# Altium schematic sheet 5_BATT+3V3.SchDoc
size A4; SheetNumber: 6; SheetTotal: 12
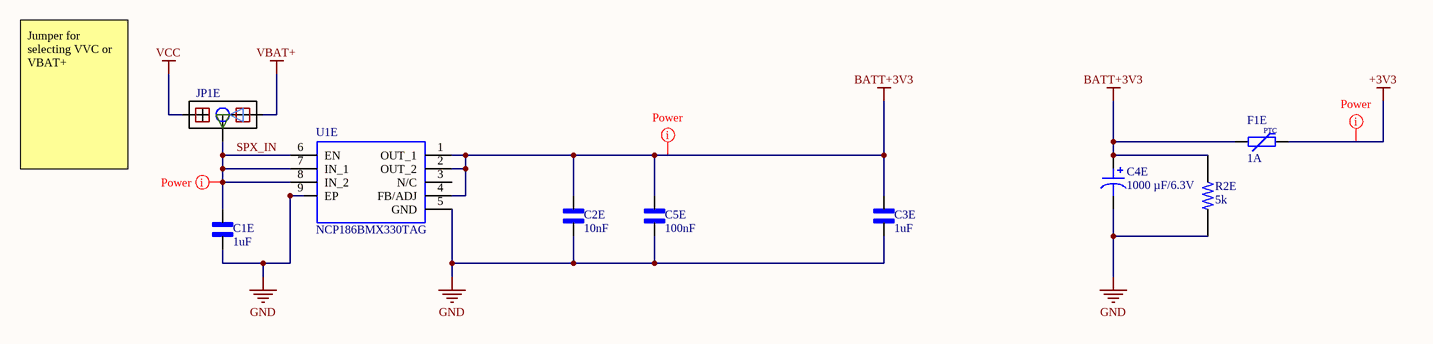
[diagram p0: 5_BATT+3V3.SchDoc]

## Parts
C1E  1uF  [C-0603]
C2E  10nF  [C-0603]
C3E  1uF  [C-0603]
C4E  1000 µF/6.3V  [CAP AL TH D8 L3.5 H12.5]
C5E  100nF  [C-0603]
F1E  1A  [FUSE_1206]
JP1E  Solder Pad  [Solder_Pad_3_Pin_NC_Medium]  (value not drawn)
R2E  5k  [R-0603]
U1E  NCP186BMX330TAG  [NCP186AMX330TAG]

## Nets
+3V3: F1E.2
BATT+3V3: C2E.2 C3E.2 C4E.1 C5E.2 F1E.1 R2E.1 U1E.1(OUT_1) U1E.2(OUT_2) U1E.4(FB/ADJ)
GND: C1E.1 C2E.1 C3E.1 C4E.2 C5E.1 R2E.2 U1E.5(GND) U1E.9(EP)
VBAT+: JP1E.1
VCC: JP1E.3
SPX_IN: C1E.2 JP1E.2 U1E.6(EN) U1E.7(IN_1) U1E.8(IN_2)

Not connected (* = marked no-connect by the designer): U1E 3(N/C)

## Layout directives
net class Power; rule Supply Nets [Voltage = 0.000]: +3V3, BATT+3V3, SPX_IN

## Notes on the sheet
- Jumper for selecting VVC or VBAT+
- (in symbol FUSE_PPTC_1206) PTC

## Library data of the parts
C1E C2E C3E C5E = C-0603: Ceramic Capacitor 16V 0603 (1608 Metric); MP: C0603C104J4RAC; MF: KEMET; SnapEDA_Link: https://www.snapeda.com/parts/C0603C104J4RAC/KEMET/view-part/1763758/?ref=snap; Availability: Warning; Package: 0603 KEMET; Check_prices: https://www.snapeda.com/parts/C0603C104J4RAC/KEMET/view-part/1763758/?ref=eda; Value: *; Price: None
C4E = ECA-0JHG102: CAP ALUM 1000UF 20% 6.3V RADIAL; manufacturer: Panasonic Electronic Components; Capacitance: 1000 µF; Lifetime @ Temp.: 1000 Hrs @ 105°C; Polarization: Polar; Ripple Current @ High Frequency: 437 mA @ 100 kHz; Ripple Current @ Low Frequency: 380 mA @ 120 Hz; Part Number: ECA-0JHG102; Applications: General Purpose; componentlink1description: Datasheet; componentlink1url: https://industrial.panasonic.com/cdbs/www-data/pdf/RDF0000/ABA0000C75.pdf; componentlink2description: DigiKey Link; componentlink2url: https://www.digikey.com/en/products/detail/panasonic-electronic-components/ECA-0JHG102/245108; Device Package: Radial, Can; Height - Seated (Max): 0.492" (12.50mm); lastupdated: 27-12-2022 10:20:14 PM; Lead Spacing: 0.138" (3.50mm); Lifecycle Status: Active; Minimum Order: 1; Mounting Type: Through Hole; Operating Temperature: -55°C ~ 105°C; Package / Case: Radial, Can; packaging: Bulk; partid: 7190; Part Status: Active; price: 0.15; series: NHG-A; Size / Dimension: 0.315" Dia (8.00mm); Supplier 1: DigiKey; Supplier Part Number 1: P5509-ND; Tolerance: ±20%; value: 1000 µF/6.3V; Voltage - Rated: 6.3 V
F1E = FUSE_PPTC_1206: Fuse PPTC SMD 1206; Manufacturer: *; Manufacturer Part Number: *
JP1E = Solder_Pad_3_Pin_NC_Medium: Solder Pad 3 Pin NC 1.016 mm Pitch
R2E = R-0603: 0603; MP: 2-1623703-0; Power_Rating: .1 W; Value: 10K; Tolerance: 1%; MF: TE Connectivity; Package: 0603; Price: None; Resistance: 10K; Check_prices: https://www.snapeda.com/parts/2-1623703-0/TE%20Connectivity/view-part/2213192/?ref=eda; SnapEDA_Link: https://www.snapeda.com/parts/2-1623703-0/TE%20Connectivity/view-part/2213192/?ref=snap; Availability: Warning
U1E = NCP186BMX330TAG: LDO Voltage Regulators FAST TRANSIENT RESPO; Manufacturer_Name: onsemi; Mouser Part Number: 863-NCP186BMX330TAG; Mouser Price/Stock: https://www.mouser.co.uk/ProductDetail/onsemi/NCP186BMX330TAG?qs=tCMd4XlZ%2FiDuLBXmI4EY0w%3D%3D; Manufacturer_Part_Number: NCP186BMX330TAG; Datasheet Link: http://www.onsemi.com/pub/Collateral/NCP186-D.PDF